# Altium schematic sheet Bluetooth.SchDoc: Bluetooth
size A4; DrawnBy: zjt14; Organization: ENEL429 Group 9; Address1: ECE Department; Address2: University of Canterbury; Address3: Christchurch 8041; Address4: New Zealand; Revision: 1; SheetNumber: 3; SheetTotal: 4
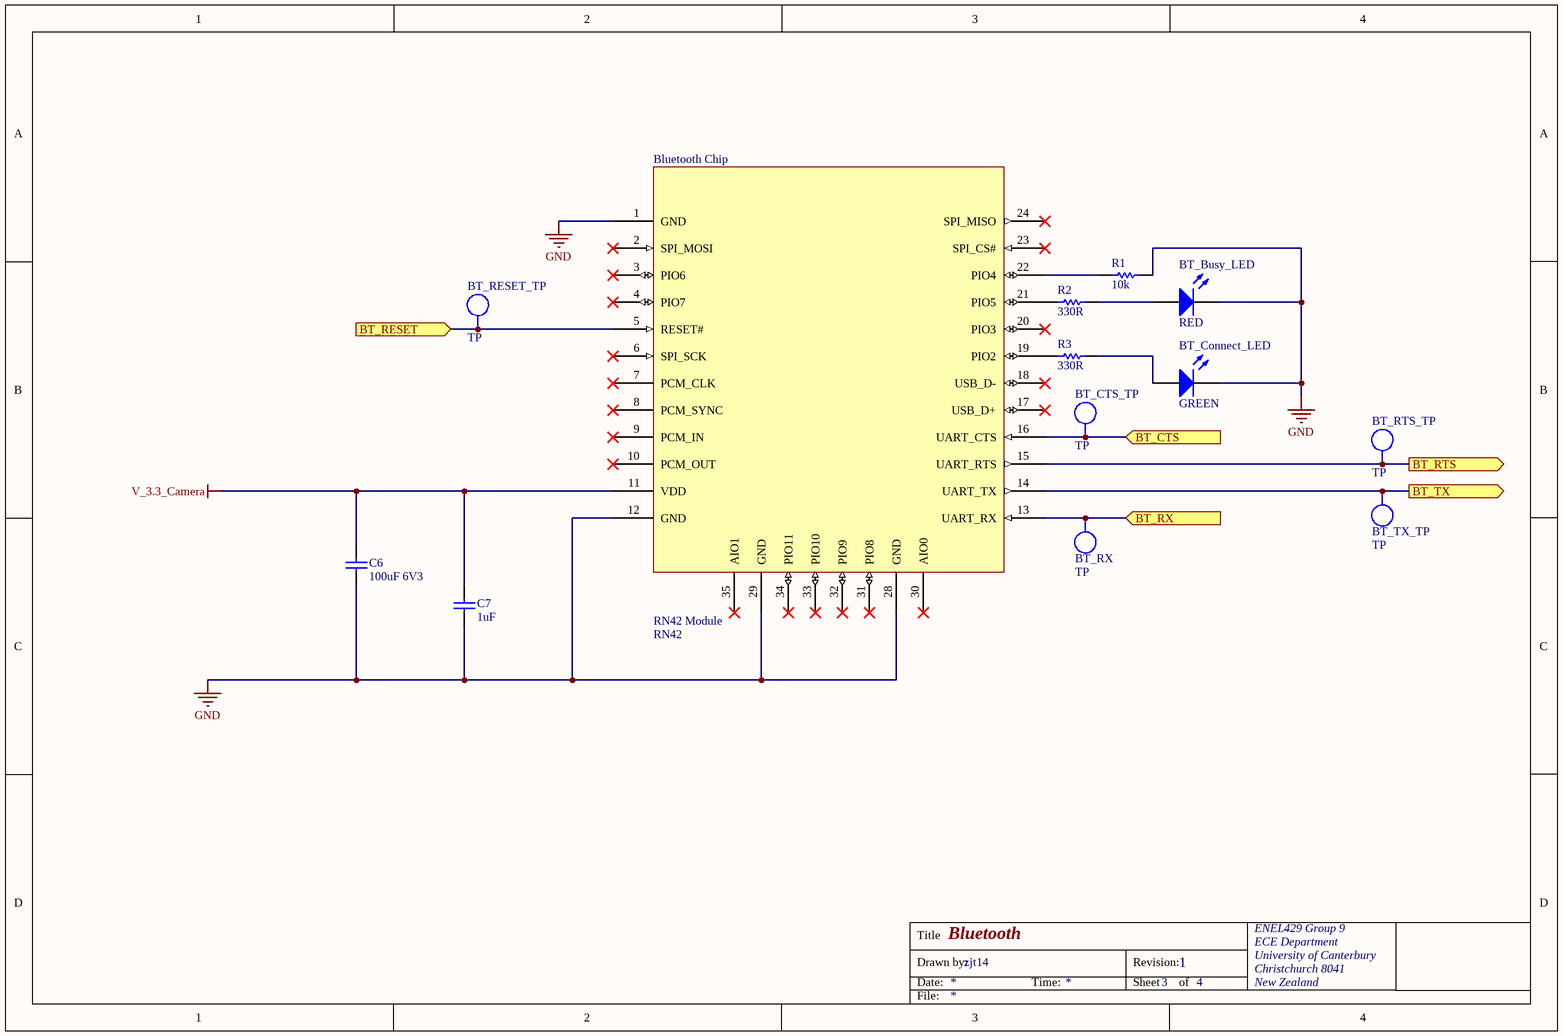
[diagram p0: Bluetooth.SchDoc]

## Parts
Bluetooth_Chip  RN42 Module  value RN42  [RN42-LAND]  (no BOM)
BT_Busy_LED  value RED  [Diode_0805]  (hidden comment: LED Red)
BT_Connect_LED  value GREEN  [DIODE_0805]  (hidden comment: LED Green)
BT_CTS_TP  TP  [TEST_POINT_4X2MM]  (no BOM)
BT_RESET_TP  TP  [TEST_POINT_4X2MM]  (no BOM)
BT_RTS_TP  TP  [TEST_POINT_4X2MM]  (no BOM)
BT_RX  TP  [TEST_POINT_4X2MM]  (no BOM)
BT_TX_TP  TP  [TEST_POINT_4X2MM]  (no BOM)
C6  100uF 6V3  [1206]
C7  1uF  [0603]
R1  10k  [0603]
R2  330R  [0603]
R3  330R  [0603]

## Ports
BT_CTS (in), BT_RESET (in), BT_RTS (out), BT_RX (in), BT_TX (out)

## Nets
GND: Bluetooth_Chip.1(GND) Bluetooth_Chip.12(GND) Bluetooth_Chip.28(GND) Bluetooth_Chip.29(GND) BT_Busy_LED.2(K) BT_Connect_LED.2(K) C6.2 C7.2 R1.2
V_3.3_Camera: Bluetooth_Chip.11(VDD) C6.1 C7.1
BT_CTS: Bluetooth_Chip.16(UART_CTS) BT_CTS_TP.1 ; port BT_CTS
BT_RESET: Bluetooth_Chip.5(RESET#) BT_RESET_TP.1 ; port BT_RESET
BT_RTS: Bluetooth_Chip.15(UART_RTS) BT_RTS_TP.1 ; port BT_RTS
BT_RX: Bluetooth_Chip.13(UART_RX) BT_RX.1 ; port BT_RX
BT_TX: Bluetooth_Chip.14(UART_TX) BT_TX_TP.1 ; port BT_TX
NetBluetooth_Chip_19: Bluetooth_Chip.19(PIO2) R3.1
NetBluetooth_Chip_21: Bluetooth_Chip.21(PIO5) R2.1
NetBluetooth_Chip_22: Bluetooth_Chip.22(PIO4) R1.1
NetBT_Busy_LED_1: BT_Busy_LED.1(A) R2.2
NetBT_Connect_LED_1: BT_Connect_LED.1(A) R3.2

Not connected (* = marked no-connect by the designer): Bluetooth_Chip 2(SPI_MOSI)* 3(PIO6)* 4(PIO7)* 6(SPI_SCK)* 7(PCM_CLK)* 8(PCM_SYNC)* 9(PCM_IN)* 10(PCM_OUT)* 17(USB_D+)* 18(USB_D-)* 20(PIO3)* 23(SPI_CS#)* 24(SPI_MISO)* 30(AIO0)* 31(PIO8)* 32(PIO9)* 33(PIO10)* 34(PIO11)* 35(AIO1)*

## Notes on the sheet
- Title
- Drawn by:
- Date:
- Time:
- Revision:
- Sheet
- of
- File:

## Library data of the parts
Bluetooth_Chip = RN42MOD: Manufacturer: Roving Networks; Manufacturer PN: RN-42; Supplier 1: Sparkfun; Supplier Part Number 1: WRL-10253
BT_Busy_LED = DL_LED Red 0805: Red LED 0805; Manufacturer PN: TLMS2100-GS08; Manufacturer: Vishay; Part Number: DL_LED Red 0805; Component Kind: Standard; Component Type: Standard; Designator: DL_LED Red 0805; Pin Count: 2; Supplier 1: Digi-Key; Supplier Part Number 1: 350-2038-1-ND; Simulation: LED0
BT_Connect_LED = DL_LED Green 0805: Green LED 0805; Manufacturer: Vishay; Verify: Not checked; Part Number: DL_LED Green 0805; Component Kind: Standard; Component Type: Standard; Designator: DL_LED Green 0805; Footprint: LED_RA_SMD; Pin Count: 2; Supplier 1: Digi-Key; Supplier Part Number 1: 160-1179-2-ND; Simulation: LED0
BT_CTS_TP BT_RESET_TP BT_RTS_TP BT_RX BT_TX_TP = TP_TESTPOINT: Test-Point; LatestRevisionDate: 29 May 08; Manufacturer PN: *; Manufacturer: *; Supplier 1: Digi-Key; Supplier Part Number 1: 5016KTR-ND; Value: TP; Part Number: TP_TESTPOINT; Component Type: Standard (No BOM); Designator: TP_TESTPOINT; Pin Count: 1
C6 = CP_CER 100uF_1206_6V3: 100uF 6.3V 1206 multi-layer ceramic capacitor; Manufacturer PN: C1206C107M9PACTU; Manufacturer: Kemet; price: 2.56; value: 100uF 6V3; Part Number: CP_CER 100uF_1206_6V3; Component Kind: Standard; Component Type: Standard; Designator: CP_CER 100uF_1206_6V3; Pin Count: 2; Supplier Part Number 1: 399-5620-1-ND; Supplier 1: Digi-Key
C7 = CP_1uF_50V_0603: CAP CER 1.0UF 50V X7R 0603; Manufacturer: Taiyo Yuden; Manufacturer PN: UMK107C5105KA-T; Value: 1uF; Part Number: CP_1uF_50V_0603; Component Kind: Standard; Component Type: Standard; Designator: CP_1uF_50V_0603; Pin Count: 2; Supplier Part Number 1: 445-5090-2-ND; Supplier 1: Digi-Key; Signal Integrity: Cap; Simulation: CAP
R1 = RS_10k 0603: RES 10.0K OHM 1/10W 1% 0603 SMD; Manufacturer: Yageo; Manufacturer PN: RC0603FR-0710KL; Value: 10k; Part Number: RS_10k 0603; Component Kind: Standard; Component Type: Standard; Designator: RS_10k 0603; Pin Count: 2; LatestRevisionDate: 29 May 08; Supplier 1: Digi-Key; Supplier Part Number 1: 311-10.0KHRTR-ND; Signal Integrity: Res; Simulation: RESISTOR
R2 R3 = RS_330R 0603: RES 330 OHM 1/10W 1% 0603 SMD; Manufacturer: Yageo; Manufacturer PN: RC0603FR-07330RL; Value: 330R; Part Number: RS_330R 0603; Component Kind: Standard; Component Type: Standard; Designator: RS_330R 0603; Pin Count: 2; LatestRevisionDate: 25 June 2009; Supplier 1: Digi-Key; Supplier Part Number 1: 311-330HRTR-ND; Signal Integrity: Res; Simulation: RESISTOR